# Altium schematic sheet CW340_SAM3X_PWR.SchDoc: MCU Power
size Letter; Organization: NewAE Technology Inc.; Address1: 1083 Queen St., Suite 196; Address2: Halifax; Address3: NS; Address4: Canada B3H 0B2; DocumentNumber: .; Revision: .; SheetNumber: 8; SheetTotal: 31; SheetApproved: YES
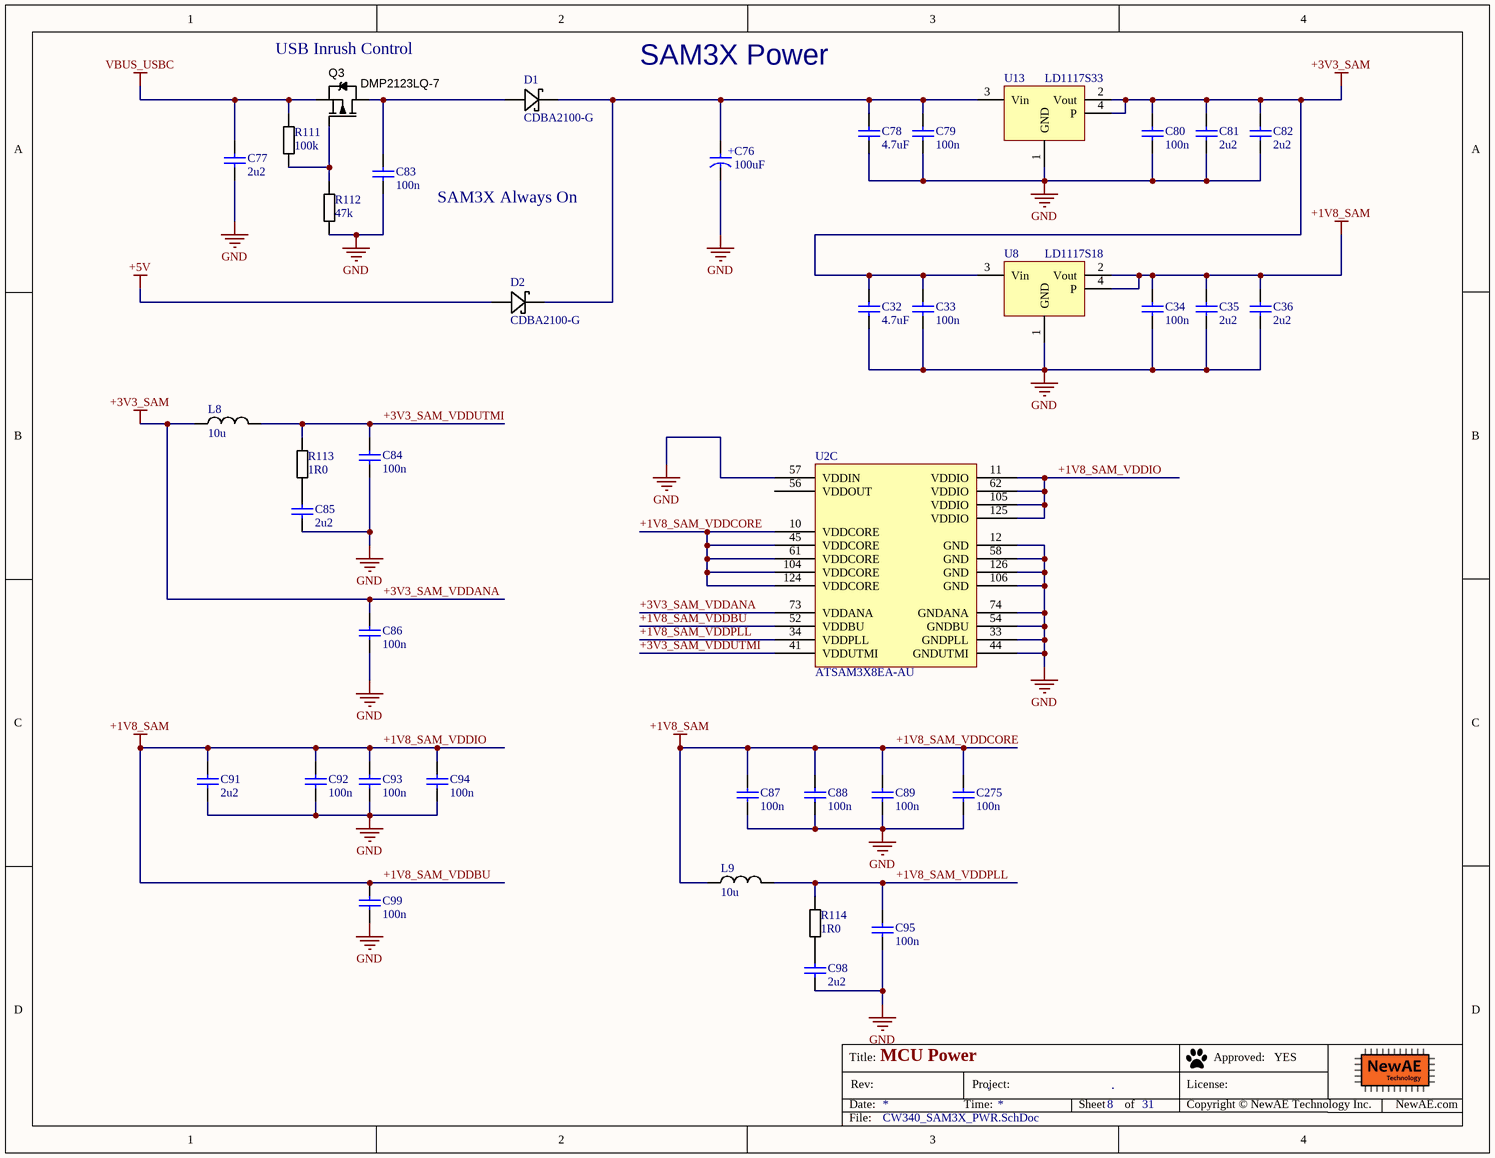
[diagram p0: CW340_SAM3X_PWR.SchDoc]

## Parts
C32  4.7uF  [CAPC0805_M]
C33  100n  [CAPC0402_M]
C34  100n  [CAPC0402_M]
C35  2u2  [CAPC0603_M]
C36  2u2  [CAPC0603_M]
C76  100uF  [CAP_AL_D6.3]
C77  2u2  [CAPC0603_M]
C78  4.7uF  [CAPC0805_M]
C79  100n  [CAPC0402_M]
C80  100n  [CAPC0402_M]
C81  2u2  [CAPC0603_M]
C82  2u2  [CAPC0603_M]
C83  100n  [CAPC0402_M]
C84  100n  [CAPC0402_M]
C85  2u2  [CAPC0603_M]
C86  100n  [CAPC0402_M]
C87  100n  [CAPC0402_M]
C88  100n  [CAPC0402_M]
C89  100n  [CAPC0402_M]
C91  2u2  [CAPC0603_M]
C92  100n  [CAPC0402_M]
C93  100n  [CAPC0402_M]
C94  100n  [CAPC0402_M]
C95  100n  [CAPC0402_M]
C98  2u2  [CAPC0603_M]
C99  100n  [CAPC0402_M]
C275  100n  [CAPC0402_M]
D1  CDBA2100-G  [DO-214AC]
D2  CDBA2100-G  [DO-214AC]
L8  10u  [IND_0603]
L9  10u  [IND_0603]
Q3  DMP2123LQ-7  [SOT95P245X110-3M]
R111  100k  [RESC1608X55N]
R112  47k  [RESC1608X55N]
R113  1R0  [RESC1608X55N]
R114  1R0  [RESC1608X55N]
U2  ATSAM3X8EA-AU  [LQFP144_L]  (part C of 3)
U8  LD1117S18  [SOT-223]
U13  LD1117S33  [SOT-223]

## Nets
+1V8_SAM_VDDBU: C34.1 C35.1 C36.1 C87.1 C88.1 C89.1 C91.1 C92.1 C93.1 C94.1 C99.1 C275.1 L9.1 U2.10(VDDCORE) U2.11(VDDIO) U2.45(VDDCORE) U2.52(VDDBU) U2.61(VDDCORE) U2.62(VDDIO) U2.104(VDDCORE) U2.105(VDDIO) U2.124(VDDCORE) U2.125(VDDIO) U8.2(Vout) U8.4(P)  [also labelled +1V8_SAM, +1V8_SAM_VDDCORE, +1V8_SAM_VDDIO]
+3V3_SAM_VDDANA: C32.1 C33.1 C80.1 C81.1 C82.1 C86.1 L8.1 U2.73(VDDANA) U8.3(Vin) U13.2(Vout) U13.4(P)  [also labelled +3V3_SAM]
+5V: D2.A
GND: C32.2 C33.2 C34.2 C35.2 C36.2 C76.2 C77.2 C78.2 C79.2 C80.2 C81.2 C82.2 C83.2 C84.2 C85.2 C86.2 C87.2 C88.2 C89.2 C91.2 C92.2 C93.2 C94.2 C95.2 C98.2 C99.2 C275.2 R112.2 U2.12(GND) U2.33(GNDPLL) U2.44(GNDUTMI) U2.54(GNDBU) U2.57(VDDIN) U2.58(GND) U2.74(GNDANA) U2.106(GND) U2.126(GND) U8.1(GND) U13.1(GND)
VBUS_USBC: C77.1 Q3.2(S) R111.1
+1V8_SAM_VDDPLL: C95.1 L9.2 R114.1 U2.34(VDDPLL)
+3V3_SAM_VDDUTMI: C84.1 L8.2 R113.1 U2.41(VDDUTMI)
NetC76_1: C76.1 C78.1 C79.1 D1.K D2.K U13.3(Vin)
NetC83_1: C83.1 D1.A Q3.3(D)
NetC85_1: C85.1 R113.2
NetC98_1: C98.1 R114.2
NetQ3_1: Q3.1(G) R111.2 R112.1

Not connected (* = marked no-connect by the designer): U2 56(VDDOUT)

## Notes on the sheet
- (near Q3) USB Inrush Control
- SAM3X Power
- SAM3X Always On
- Title:
- Date:
- Rev:
- Time:
- Project:
- Sheet
- of
- License:
- Copyright © NewAE Technology Inc.
- Approved:
- NewAE.com
- File:
- (in symbol Cap_35v_100uF) +

## Library data of the parts
C32 C78 = CCHIP-4u7-0805-35V: 4u7, 35V, 0805, Ceramic; Manufacture 1: Murata; Manufacture Part Number 1: GRT21BC8YA475KE13L; Component Group: Capacitor; Case-EIA: 0805; Case-Metric: 1608; Rated Voltage: 35VDC; Tolerance: 10%; Part Number: CCHIP-4u7-0805-35V; Footprint: 0805; Pin Count: 2; Supplier 1: Digi-Key; Supplier Part Number 1: 490-12361-1-ND; Value: 4.7uF; Mounting Technology: SMT; Temperature Range: -55C to 85C; Component Kind: Standard; Component Type: Standard
C33 C34 C79 C80 C83 C84 C86-C89 C92-C95 C99 C275 = CCHIP-100n-0402: 100n, 0402; Manufacture Part Number 1: CGA2B3X7R1V104K050BB; Component Group: Capacitor; Case-EIA: 0402; Part Number: CCHIP-100n-0402; Footprint: 0402; Pin Count: 2; Value: 100n; Mounting Technology: SMT; Component Kind: Standard; Component Type: Standard; Supplier 1: Digi-Key; Supplier Part Number 1: 445-6901-1-ND
C35 C36 C77 C81 C82 C85 C91 C98 = CCHIP-2u2-0603: 2u2, 0603; Manufacture 1: Samsung; Manufacture Part Number 1: CL10B225KP8NNNC; Component Group: Capacitor; Case-EIA: 0603; Case-Metric: 1608; Rated Voltage: 10VDC; Part Number: CCHIP-2u2-0603; Footprint: 0603; Pin Count: 2; Supplier 1: Digi-Key; Supplier Part Number 1: 1276-1134-1-ND; Value: 2u2; Mounting Technology: SMT; Component Kind: Standard; Component Type: Standard
C76 = Cap_35v_100uF: CAP ALUM 100UF 20% 35V RADIAL; Manufacture 1: Panasonic Electronic Components; Manufacture Part Number 1: ECA-1VM101; Component Group: Capacitor; PP Material Stack: 0; Part Number: Cap_35v_100uF; Pin Count: 2; Supplier 1: Digi-Key; Supplier Part Number 1: P5165-ND; Value: 100uF; Mounting Technology: Through-hole; RoHS: Yes; Component Kind: Standard; Component Type: Standard; PP Rotation: 0
D1 D2 = CDBA2100-G: Diode Schottky, 100V, 2A; Manufacture 1: Comchip Technology; Part Number: CDBA2100-G; Component Group: Diode; Footprint: SMA; Manufacture Part Number 1: CDBA2100-G; Pin Count: 2; Supplier 1: Digi-Key; Supplier Part Number 1: 641-1094-1-ND; Mounting Technology: SMT; RoHS: Yes; Component Kind: Standard; Component Type: Standard
L8 L9 = LCHIP-10U-0603: FIXED IND 10UH 50MA 900 MOHM SMD; Manufacture 1: Murata Electronics North America; Manufacture Part Number 1: LQM18FN100M00D; Component Group: Inductor; Case-EIA: 0603; Case-Metric: 1608; Tolerance: ±20%; PP Material Stack: 0; Part Number: LCHIP-10U-0603; Footprint: 0603; Pin Count: 2; Supplier 1: Digi-Key; Supplier Part Number 1: 490-4025-1-ND; Value: 10u; Mounting Technology: SMT; Component Kind: Standard; Component Type: Standard; PP Rotation: 0
Q3 = DMP2123LQ-7: P-Channel, 3A, Logic Level; Manufacture 1: Diodes Inc.; Component Group: MOSFET; Part Number: DMP2123LQ-7; Footprint: SOT23; Manufacture Part Number 1: DMP2123LQ-7; Pin Count: 3; Supplier 1: Digi-Key; Supplier Part Number 1: DMP2123LQ-7DICT-ND; Mounting Technology: SMT; Component Kind: Standard; Component Type: Standard
R111 = RCHIP-100K-0603: 100k res, 0603, 1%, 1/10W; Manufacture 1: Yageo; Manufacture Part Number 1: RC0603FR-07100KL; Component Group: Resistor; Case-EIA: 0603; Case-Metric: 1608; Rated Power: 0.1W; Rated Voltage: 75VDC; Part Number: RCHIP-100K-0603; Footprint: 0603; Pin Count: 2; Supplier 1: Digi-Key; Supplier Part Number 1: 311-100KHRCT-ND; Value: 100k; Tolerance: 1%; Mounting Technology: SMT; Temperature Range: -55C to 155C; Component Kind: Standard; Component Type: Standard
R112 = RCHIP-47K-0603: 47k res, 0603, 1%, 1/10W; Manufacture 1: Yageo; Manufacture Part Number 1: RC0603FR-0747KL; Component Group: Resistor; Case-EIA: 0603; Case-Metric: 1608; Rated Power: 0.1W; Rated Voltage: 75VDC; Part Number: RCHIP-47K-0603; Footprint: 0603; Pin Count: 2; Supplier 1: Digi-Key; Supplier Part Number 1: 311-47.0KHRCT-ND; Value: 47k; Tolerance: 1%; Mounting Technology: SMT; Temperature Range: -55C to 155C; Component Kind: Standard; Component Type: Standard
R113 R114 = RCHIP-1R0-0603: 1R0 res, 0603, 1%, 1/10W; Manufacture 1: Yageo; Manufacture Part Number 1: RC0603FR-071RL; Component Group: Resistor; Case-EIA: 0603; Case-Metric: 1608; Rated Power: 0.1W; Rated Voltage: 75VDC; Part Number: RCHIP-1R0-0603; Footprint: 0603; Pin Count: 2; Supplier 1: Digi-Key; Supplier Part Number 1: 311-1.00HRCT-ND; Value: 1R0; Tolerance: 1%; Mounting Technology: SMT; Temperature Range: -55C to 155C; Component Kind: Standard; Component Type: Standard
U2 = CMP-0076-00188-1: SAM3X ARM Cortex-M3 Flash-based Microcontroller, 512 KB Flash, 96 KB SRAM, 103 User I/Os, 1.62 to 3.6 V, -40 to 85 degC, 144-Pin LQFP, RoHS; Manufacturer: Atmel; UART: 5; Max. Operating Freq.: 84 MHz; ADC Resolution: 12 bits; Flash: 512 Kbytes; ADC Channels: 16; SRAM: 96 Kbytes; Max I/O Pins: 103; DAC Channels: 2; SPI: 4; # of Touch Channels: 32; Mounting Technology: Surface Mount; Operating Voltage: 1.62 to 3.6 V; ComponentLink2URL: http://www.atmel.com/Images/doc11057.pdf; CAN: 2; ComponentLink1Description: Manufacturer URL; RoHS: TRUE; PartNumber: ATSAM3X8EA-AU; Temp. Range: -40 to 85 degC; PackageVersion: 11057B; PackageDescription: 100-Pin Quad Flat Package, Body 20 x 20 mm, Pitch 0.5 mm; ComponentLink2Description: Datasheet; DatasheetVersion: 11057B; ComponentLink1URL: http://www.atmel.com/; ComponentLink3Description: Package Specification; ComponentLink3URL: http://www.atmel.com/Images/doc11057.pdf; PackageReference: LQFP-144
U8 = LD1117S18: IC REG LIN POS 1.8V 800MA SOT223; Manufacture 1: STMicroelectronics; Manufacture Part Number 1: LD1117S18TR; Component Group: Analog IC; Rated Voltage: 15V; PP Material Stack: 0; Part Number: LD1117S18; Pin Count: 3; Supplier 1: Digi-Key; Supplier Part Number 1: 497-7308-1-ND; Mounting Technology: SMT; RoHS: Yes; Component Kind: Standard; Component Type: Standard; PP Rotation: 0
U13 = LD1117S33: IC REG LIN POS 3.3V 800MA SOT223; Manufacture 1: STMicroelectronics; Manufacture Part Number 1: LD1117S33TR; Component Group: Analog IC; Rated Voltage: 15V; PP Material Stack: 0; Part Number: LD1117S33; Pin Count: 3; Supplier 1: Digi-Key; Supplier Part Number 1: 497-1242-1-ND; Mounting Technology: SMT; RoHS: Yes; Component Kind: Standard; Component Type: Standard; PP Rotation: 0